# Altium schematic sheet ESP32.SchDoc: WIFI ESP32
size A3; DocumentNumber: 5; SheetNumber: 1; SheetTotal: 5
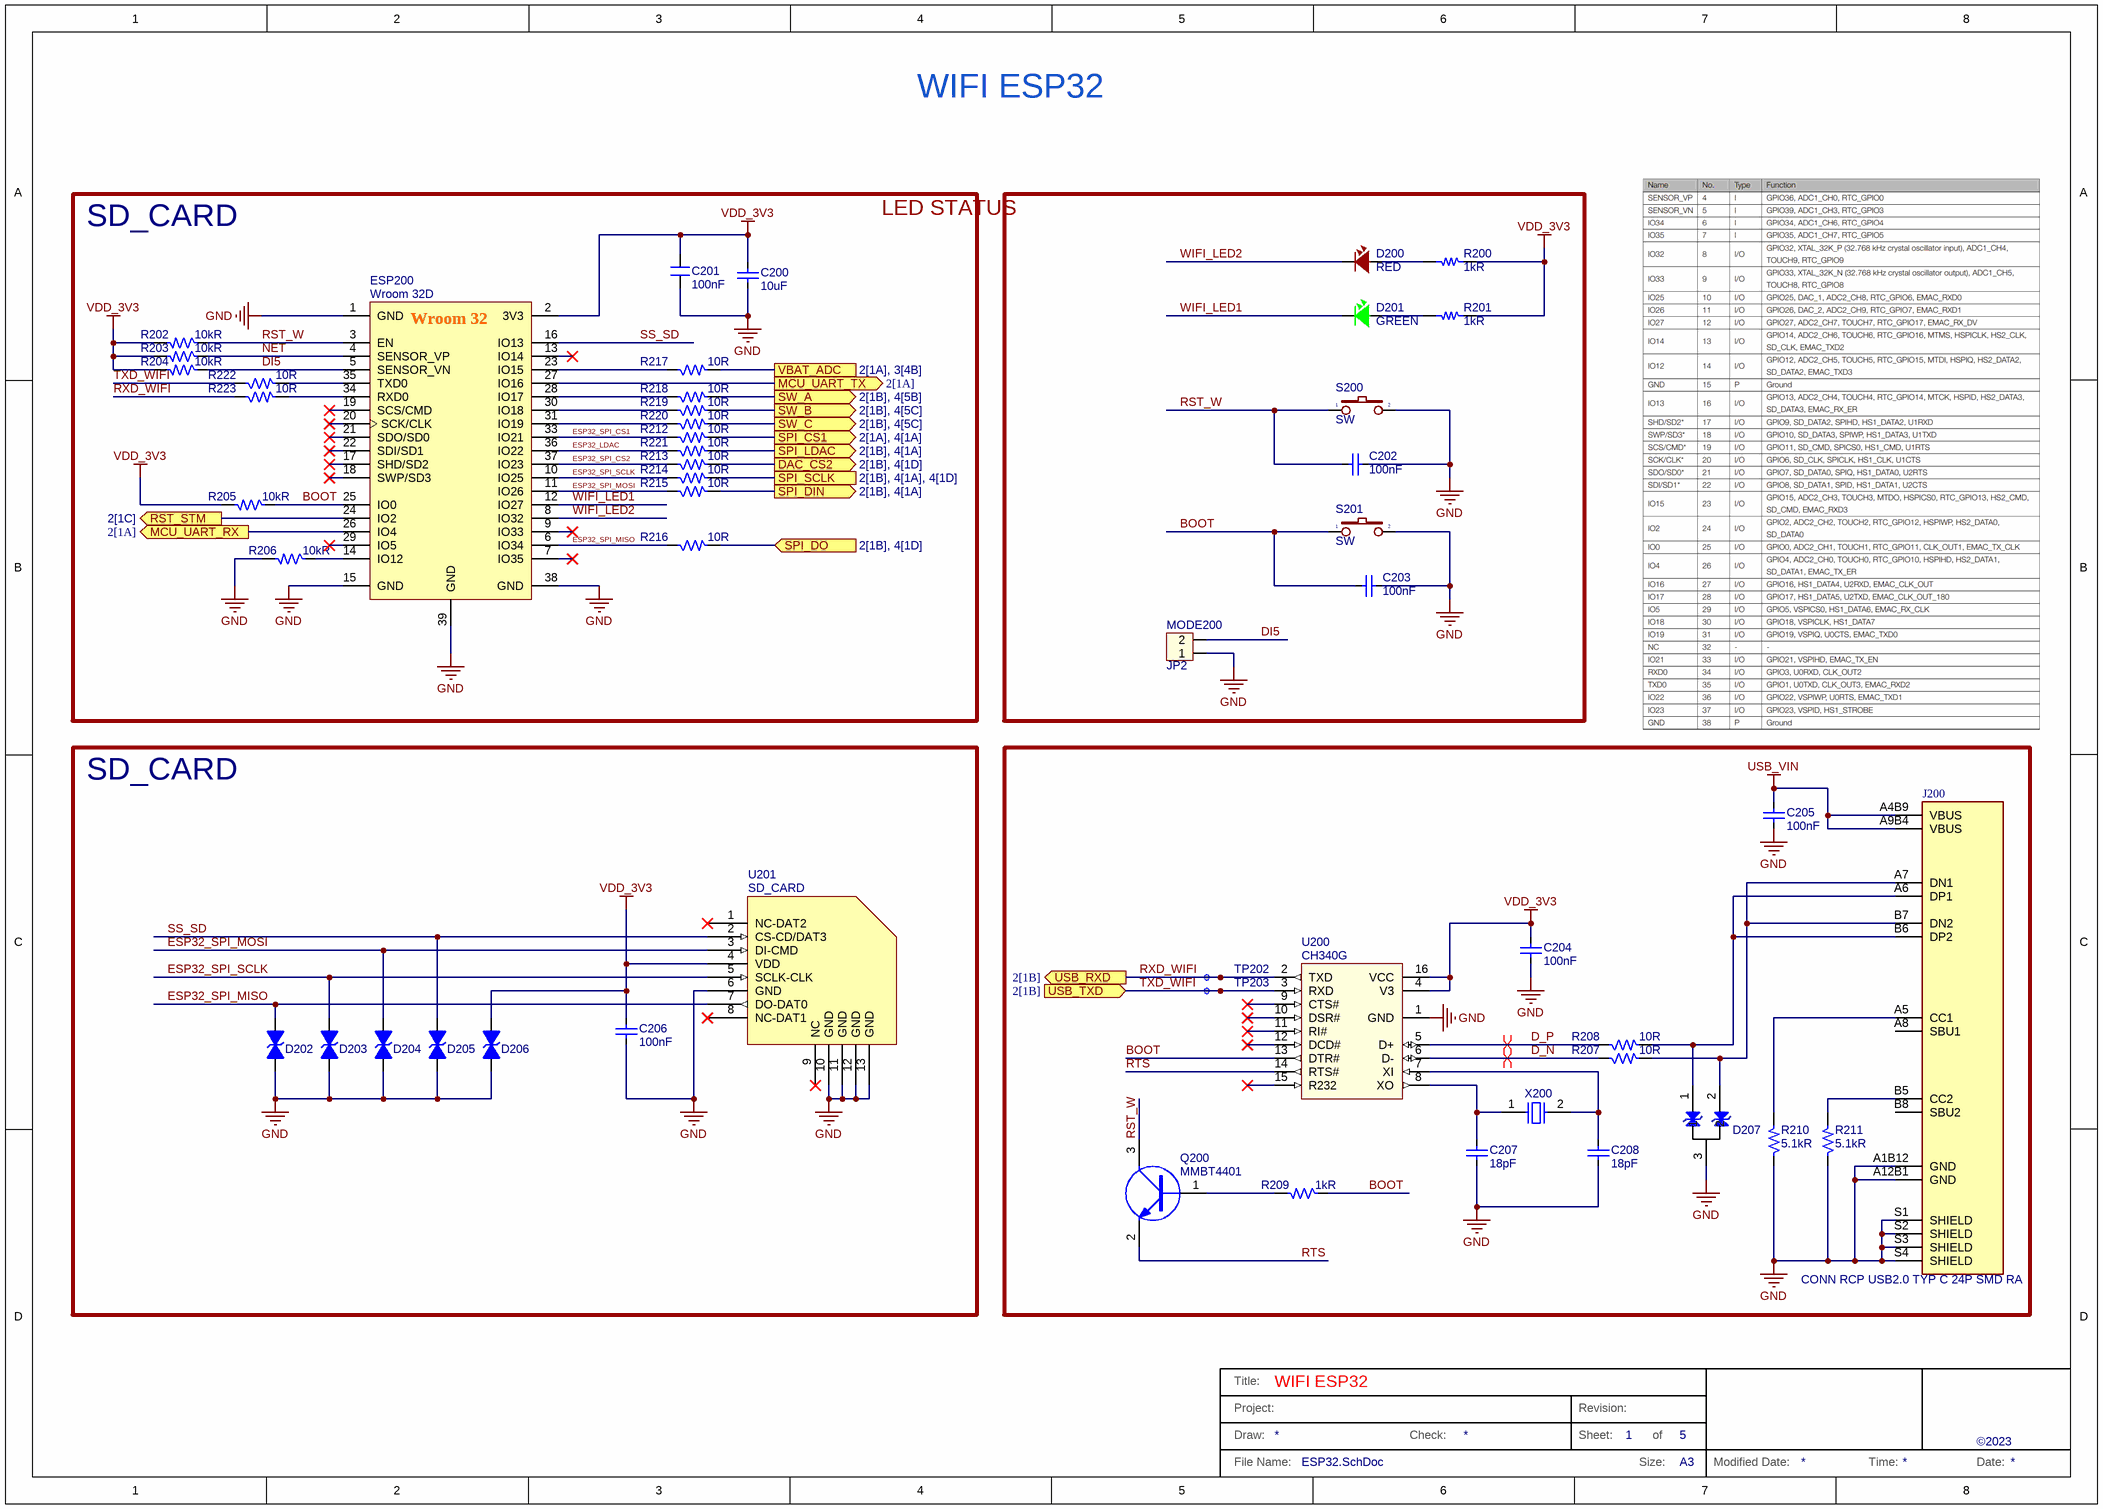
[diagram p0: ESP32.SchDoc]

## Parts
C200  10uF  [C0805]
C201  100nF  [CAP0603-M]
C202  100nF  [CAP0603-M]
C203  100nF  [CAP0603-M]
C204  100nF  [CAP0603-M]
C205  100nF  [CAP0603-M]
C206  100nF  [CAP0603-M]
C207  18pF  [CAP0603-M]
C208  18pF  [CAP0603-M]
D200  RED  [LED-0603-Red]
D201  GREEN  [LED-0603-Green]
D202  ESDAXLC6-1BU2  [2-UDFN]  (value not drawn)
D203  ESDAXLC6-1BU2  [2-UDFN]  (value not drawn)
D204  ESDAXLC6-1BU2  [2-UDFN]  (value not drawn)
D205  ESDAXLC6-1BU2  [2-UDFN]  (value not drawn)
D206  ESDAXLC6-1BU2  [2-UDFN]  (value not drawn)
D207  DESD2CAN2SOQ-7  [SOT23-3]  (value not drawn)
ESP200  Wroom 32D  [ESP32_UE]
J200  CONN RCP USB2.0 TYP C 24P SMD RA  [USB_USB4110-GF-A]
MODE200  JP2  [XH2.54]
Q200  MMBT4401  [SOT23-3]
R200  1kR  [R_0603]
R201  1kR  [R_0603]
R202  10kR  [R_0603]
R203  10kR  [R_0603]
R204  10kR  [R_0603]
R205  10kR  [R_0603]
R206  10kR  [R_0603]
R207  10R  [R_0603]
R208  10R  [R_0603]
R209  1kR  [R_0603]
R210  5.1kR  [R_0603]
R211  5.1kR  [R_0603]
R212  10R  [R_0603]
R213  10R  [R_0603]
R214  10R  [R_0603]
R215  10R  [R_0603]
R216  10R  [R_0603]
R217  10R  [R_0603]
R218  10R  [R_0603]
R219  10R  [R_0603]
R220  10R  [R_0603]
R221  10R  [R_0603]
R222  10R  [R_0603]
R223  10R  [R_0603]
S200  SW  [BUTTON_2P_SMD]
S201  SW  [BUTTON_2P_SMD]
TP202  RXD  [TPH]  (value not drawn)  (no BOM)
TP203  TXD  [TPH]  (value not drawn)  (no BOM)
U200  CH340G  [SOIC-16]
U201  SD_CARD  [MICROSD2]
X200  WTL5G60391VH  [XTAL_SMD_3P5]  (value not drawn)

## Blocks framed on the sheet
SD_CARD: C200 C201 ESP200 R202-R206 R212-R223
LED STATUS: C202 C203 D200 D201 MODE200 R200 R201 S200 S201
SD_CARD: C206 D202-D206 U201

## Ports
DAC_CS2 (out, see 2[1B], 4[1D]), MCU_UART_RX (out, see 2[1A]), MCU_UART_TX (out, see 2[1A]), RST_STM (out, see 2[1C]), SPI_CS1 (out, see 2[1A], 4[1A]), SPI_DIN (out, see 2[1B], 4[1A]), SPI_DO (in, see 2[1B], 4[1D]), SPI_LDAC (out, see 2[1B], 4[1A]), SPI_SCLK (see 2[1B], 4[1A], 4[1D]), SW_A (out, see 2[1B], 4[5B]), SW_B (out, see 2[1B], 4[5C]), SW_C (out, see 2[1B], 4[5C]), USB_RXD (out, see 2[1B]), USB_TXD (in, see 2[1B]), VBAT_ADC (see 2[1A], 3[4B])

## Nets
GND: C200.1 C201.1 C202.1 C203.1 C204.1 C205.1 C206.1 C207.2 C208.2 D202.2(K) D203.2(K) D204.2(K) D205.2(K) D206.2(K) D207.3 ESP200.1(GND) ESP200.15(GND) ESP200.38(GND) ESP200.39(GND) J200.A1B12(GND) J200.A12B1(GND) J200.S1(SHIELD) J200.S2(SHIELD) J200.S3(SHIELD) J200.S4(SHIELD) MODE200.1 R206.2 R210.1 R211.1 S200.2 S201.2 U200.1(GND) U201.6(GND) U201.10(GND) U201.11(GND) U201.12(GND) U201.13(GND)
USB_VIN: C205.2 J200.A4B9(VBUS) J200.A9B4(VBUS)
VDD_3V3: C200.2 C201.2 C204.2 C206.2 D206.1(A) ESP200.2(3V3) R200.2 R201.2 R202.2 R203.2 R204.2 R205.2 U200.4(V3) U200.16(VCC) U201.4(VDD)
BOOT: C203.2 ESP200.25(IO0) R205.1 R209.1 S201.1 U200.13(DTR#)
D_N: R207.1 U200.6(D-)
D_P: R208.1 U200.5(D+)
DAC_CS2: R213.2 ; port DAC_CS2
DI5: ESP200.5(SENSOR_VN) MODE200.2 R204.1
ESP32_LDAC: ESP200.36(IO22) R221.1
ESP32_SPI_CS1: ESP200.33(IO21) R212.1
ESP32_SPI_CS2: ESP200.37(IO23) R213.1
ESP32_SPI_MISO: D202.1(A) ESP200.6(IO34) R216.1 U201.7(DO-DAT0)
ESP32_SPI_MOSI: D204.1(A) ESP200.11(IO26) R215.1 U201.3(DI-CMD)
ESP32_SPI_SCLK: D203.1(A) ESP200.10(IO25) R214.1 U201.5(SCLK-CLK)
MCU_UART_RX: ESP200.26(IO4) ; port MCU_UART_RX
MCU_UART_TX: ESP200.27(IO16) ; port MCU_UART_TX
NET: ESP200.4(SENSOR_VP) R203.1
RST_STM: ESP200.24(IO2) ; port RST_STM
RST_W: C202.2 ESP200.3(EN) Q200.3(C) R202.1 S200.1
RTS: Q200.2(E) U200.14(RTS#)
RXD_WIFI: R223.1 TP202.1(TP) U200.2(TXD) ; port USB_RXD
SPI_CS1: R212.2 ; port SPI_CS1
SPI_DIN: R215.2 ; port SPI_DIN
SPI_DO: R216.2 ; port SPI_DO
SPI_LDAC: R221.2 ; port SPI_LDAC
SPI_SCLK: R214.2 ; port SPI_SCLK
SS_SD: D205.1(A) ESP200.16(IO13) U201.2(CS-CD/DAT3)
SW_A: R218.2 ; port SW_A
SW_B: R219.2 ; port SW_B
SW_C: R220.2 ; port SW_C
TXD_WIFI: R222.1 TP203.1(TP) U200.3(RXD) ; port USB_TXD
VBAT_ADC: R217.2 ; port VBAT_ADC
WIFI_LED1: D201.2 ESP200.12(IO27)
WIFI_LED2: D200.2 ESP200.8(IO32)
NetC207_1: C207.1 U200.8(XO) X200.1
NetC208_1: C208.1 U200.7(XI) X200.2
NetD200_1: D200.1 R200.1
NetD201_1: D201.1 R201.1
NetD207_1: D207.1 J200.A6(DP1) J200.B6(DP2) R208.2
NetD207_2: D207.2 J200.A7(DN1) J200.B7(DN2) R207.2
NetESP200_14: ESP200.14(IO12) R206.1
NetESP200_23: ESP200.23(IO15) R217.1
NetESP200_28: ESP200.28(IO17) R218.1
NetESP200_30: ESP200.30(IO18) R219.1
NetESP200_31: ESP200.31(IO19) R220.1
NetESP200_34: ESP200.34(RXD0) R223.2
NetESP200_35: ESP200.35(TXD0) R222.2
NetJ200_A5: J200.A5(CC1) R210.2
NetJ200_B5: J200.B5(CC2) R211.2
NetQ200_1: Q200.1(B) R209.2

Not connected (* = marked no-connect by the designer): ESP200 7(IO35)* 9(IO33)* 13(IO14)* 17(SHD/SD2)* 18(SWP/SD3)* 19(SCS/CMD)* 20(SCK/CLK)* 21(SDO/SD0)* 22(SDI/SD1)* 29(IO5)*; J200 A8(SBU1) B8(SBU2); U200 9(CTS#)* 10(DSR#)* 11(RI#)* 12(DCD#)* 15(R232)*; U201 1(NC-DAT2)* 8(NC-DAT1)* 9(NC)*

## Layout directives
differential pair; differential pair class 90Ohm: D_N, D_P

## Notes on the sheet
- Title:
- Project:
- Draw:
- Check:
- Revision:
- Sheet:
- of
- ©2023
- File Name:
- Size:
- A3
- Modified Date:
- Time:
- Date:
- (in symbol ESP-WROOM-32) Wroom 32

## Library data of the parts
C200 = CapSMD: CAP CER 10UF 16V X5R 0603
C201 = S1200-000091: CAP CER 100nF 16V X5R 0603; Manufacturer: MURATA; Component Kind: Standard; Footprint: C_0603
C202-C206 = CapSMD: CAP CER 100nF 16V X5R 0603
C207 C208 = CapSMD: CAP CER 18PF 50V C0G/NP0 0603
D200 = LED_3: LED RED
D201 = LED_1: LED GREEN
D202-D206 = ESDAXLC6-1BU2: TVS DIODE 3VWM 17VC ST0201; Manufacturer: STMicroelectronics; Capacitance: 0.5pF; Manufacturer Part Number 1: ESDAXLC6-1BU2; Manufacturer 1: STMicroelectronics; Manufacturer Part Number: ESDAXLC6-1BU2
D207 = NUP2105: TVS DIODE 24VWM 41VC SOT23; Manufacturer: onsemi
ESP200 = ESP-WROOM-32
J200 = USB_TypeC_USB4110-GF-A: Conn USB Type C RCP 16 POS 0.3mm/0.5mm Solder ST SMD 16 Terminal 1 Port T/R; Manufacturer 1: Global Connector Technology; Manufacturer Part Number 1: USB4110-GF-A
MODE200 = Con2: Connector 2
Q200 = C1815: NPN 600mW, ECB
R200 R201 = Resistor - SMD: RES SMD 1K OHM 1% 1/8W 0603; Manufacturer: Generic Components
R202-R206 = R: RES SMD 10K OHM 1% 1/8W 0603; Manufacturer: Yageo
R207 R208 R212-R223 = R: RES SMD 10R OHM 1% 1/8W 0603; Manufacturer: Yageo
R209 = R: RES SMD 1K OHM 1% 1/8W 0603; Manufacturer: Yageo
R210 R211 = R: Resistor 1/4W; Manufacturer: Yageo
S200 S201 = SW2: Switch button 2 pin
TP202 TP203 = S1400-000002: Test_Point_1mm; Footprint: TP_1mm
U200 = CH340G: USB to UART Interface; Manufacturer: WCH; Manufacturer Part Number 1: CH340G
U201 = MicroSD: SD/MMC holder; Manufacturer Part Number 1: SD_CARD
X200 = Xtal_2P_SMD_5P0X3P5_8Mhz: XTal 8Mhz; Manufacturer: WTL; Manufacturer Part Number 1: WTL5G60391VH